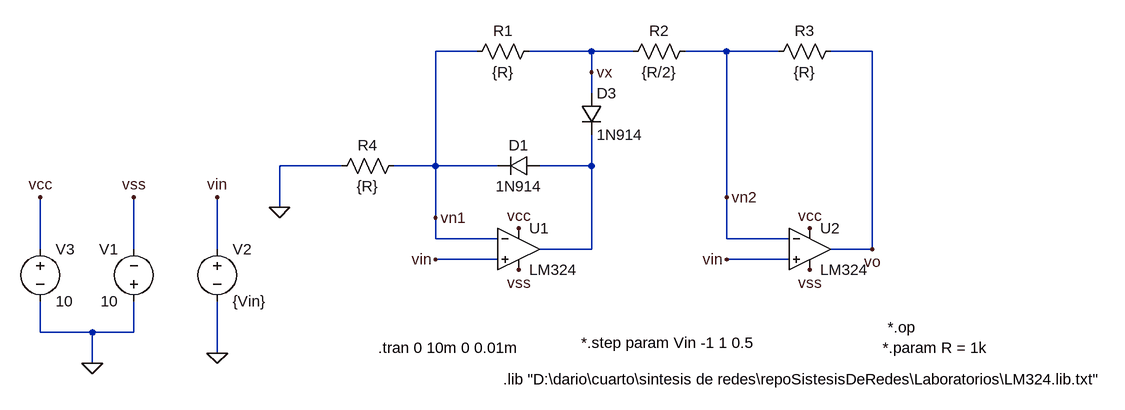
[diagram p0: schematic ejer1_17.asc]
ejer1_17.asc, the LTspice schematic file:
Version 4
SHEET 1 1212 680
WIRE 128 -144 64 -144
WIRE 304 -144 208 -144
WIRE 368 -144 304 -144
WIRE 512 -144 448 -144
WIRE 592 -144 512 -144
WIRE 736 -144 672 -144
WIRE 304 -112 304 -144
WIRE 304 -80 304 -112
WIRE -80 32 -176 32
WIRE 64 32 64 -144
WIRE 64 32 0 32
WIRE 160 32 64 32
WIRE 304 32 304 -16
WIRE 304 32 224 32
WIRE 512 80 512 -144
WIRE -176 96 -176 32
WIRE 64 112 64 32
WIRE 64 144 64 112
WIRE 160 144 64 144
WIRE 512 144 512 80
WIRE 608 144 512 144
WIRE -544 160 -544 80
WIRE -400 160 -400 80
WIRE -272 160 -272 80
WIRE 304 160 304 32
WIRE 304 160 224 160
WIRE 736 160 736 -144
WIRE 736 160 672 160
WIRE 160 176 64 176
WIRE 608 176 512 176
WIRE -544 288 -544 240
WIRE -464 288 -544 288
WIRE -400 288 -400 240
WIRE -400 288 -464 288
WIRE -272 320 -272 240
WIRE -464 336 -464 288
FLAG -272 320 0
FLAG -464 336 0
FLAG -544 80 vcc
FLAG -400 80 vss
FLAG 192 192 vss
FLAG 192 128 vcc
FLAG 640 192 vss
FLAG 640 128 vcc
FLAG -176 96 0
FLAG -272 80 vin
FLAG 64 176 vin
FLAG 512 176 vin
FLAG 64 112 vn1
FLAG 512 80 vn2
FLAG 304 -112 vx
FLAG 736 160 vo
SYMBOL Opamps\\opamp2 192 96 R0
SYMATTR InstName U1
SYMATTR Value LM324
SYMBOL diode 224 16 R90
WINDOW 0 0 32 VBottom 2
WINDOW 3 32 32 VTop 2
SYMATTR InstName D1
SYMATTR Value 1N914
SYMBOL diode 288 -80 R0
SYMATTR InstName D3
SYMATTR Value 1N914
SYMBOL res 224 -160 R90
WINDOW 0 0 56 VBottom 2
WINDOW 3 32 56 VTop 2
SYMATTR InstName R1
SYMATTR Value {R}
SYMBOL res 464 -160 R90
WINDOW 0 0 56 VBottom 2
WINDOW 3 32 56 VTop 2
SYMATTR InstName R2
SYMATTR Value {R/2}
SYMBOL res 688 -160 R90
WINDOW 0 0 56 VBottom 2
WINDOW 3 32 56 VTop 2
SYMATTR InstName R3
SYMATTR Value {R}
SYMBOL res 16 16 R90
WINDOW 0 0 56 VBottom 2
WINDOW 3 32 56 VTop 2
SYMATTR InstName R4
SYMATTR Value {R}
SYMBOL Opamps\\opamp2 640 96 R0
SYMATTR InstName U2
SYMATTR Value LM324
SYMBOL voltage -272 144 R0
WINDOW 123 0 0 Left 0
WINDOW 39 0 0 Left 0
SYMATTR InstName V2
SYMATTR Value {Vin}
SYMBOL voltage -544 144 R0
WINDOW 123 0 0 Left 0
WINDOW 39 0 0 Left 0
SYMATTR InstName V3
SYMATTR Value 10
SYMBOL voltage -400 256 R180
WINDOW 0 24 96 Left 2
WINDOW 3 24 16 Left 2
WINDOW 123 0 0 Left 0
WINDOW 39 0 0 Left 0
SYMATTR InstName V1
SYMATTR Value 10
TEXT 168 360 Left 2 !.lib "D:\\dario\\cuarto\\sintesis de redes\\repoSistesisDeRedes\\Laboratorios\\LM324.lib.txt"
TEXT -24 312 Left 2 !.tran 0 10m 0 0.01m
TEXT 288 304 Left 2 !*.step param Vin -1 1 0.5
TEXT 752 312 Left 2 !*.param R = 1k
TEXT 760 280 Left 2 !*.op

The netlist it stands for:
* ejer1_17.asc
XU1 vin vn1 vcc vss N001 LM324  ; pins In+ In- V+ V- OUT
D1 N001 vn1 1N914
D3 vx N001 1N914
R1 vx vn1 {R}
R2 vn2 vx {R/2}
R3 vo vn2 {R}
R4 vn1 0 {R}
XU2 vin vn2 vcc vss vo LM324  ; pins In+ In- V+ V- OUT
V2 vin 0 {Vin}
V3 vcc 0 10
V1 0 vss 10
.model D D
.lib standard.dio
.lib "D:\dario\cuarto\sintesis de redes\repoSistesisDeRedes\Laboratorios\LM324.lib.txt"
.tran 0 10m 0 0.01m
*.step param Vin -1 1 0.5
*.param R = 1k
*.op
.backanno
.end